# EAGLE design mcu (EAGLE 7.7.0)
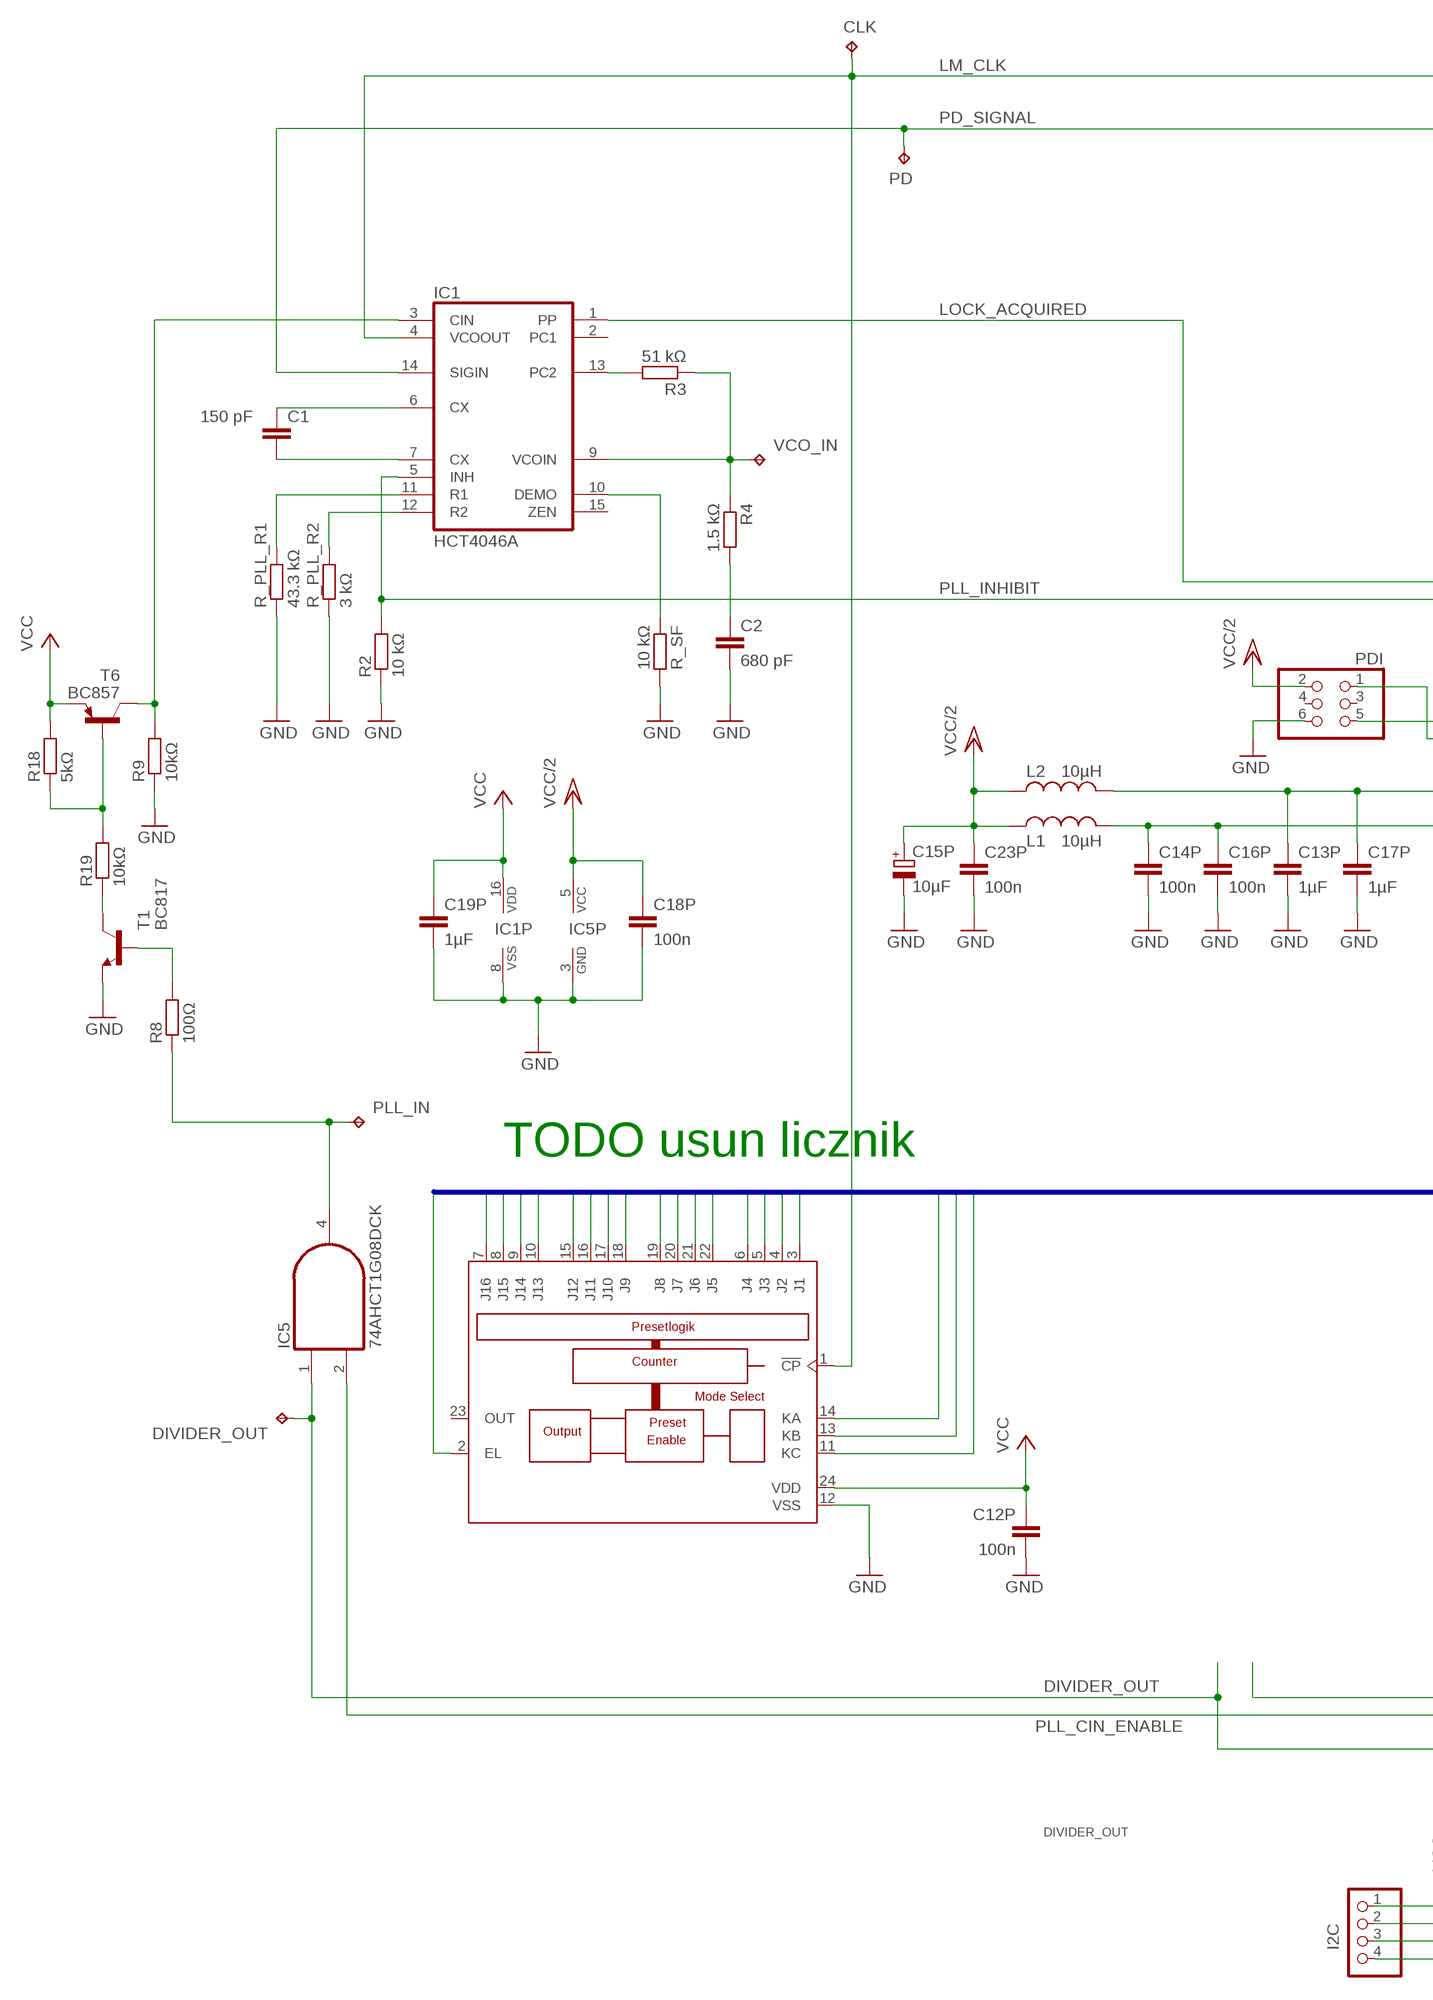
[diagram p0: schematic, sheet 1, part 1 of 2]
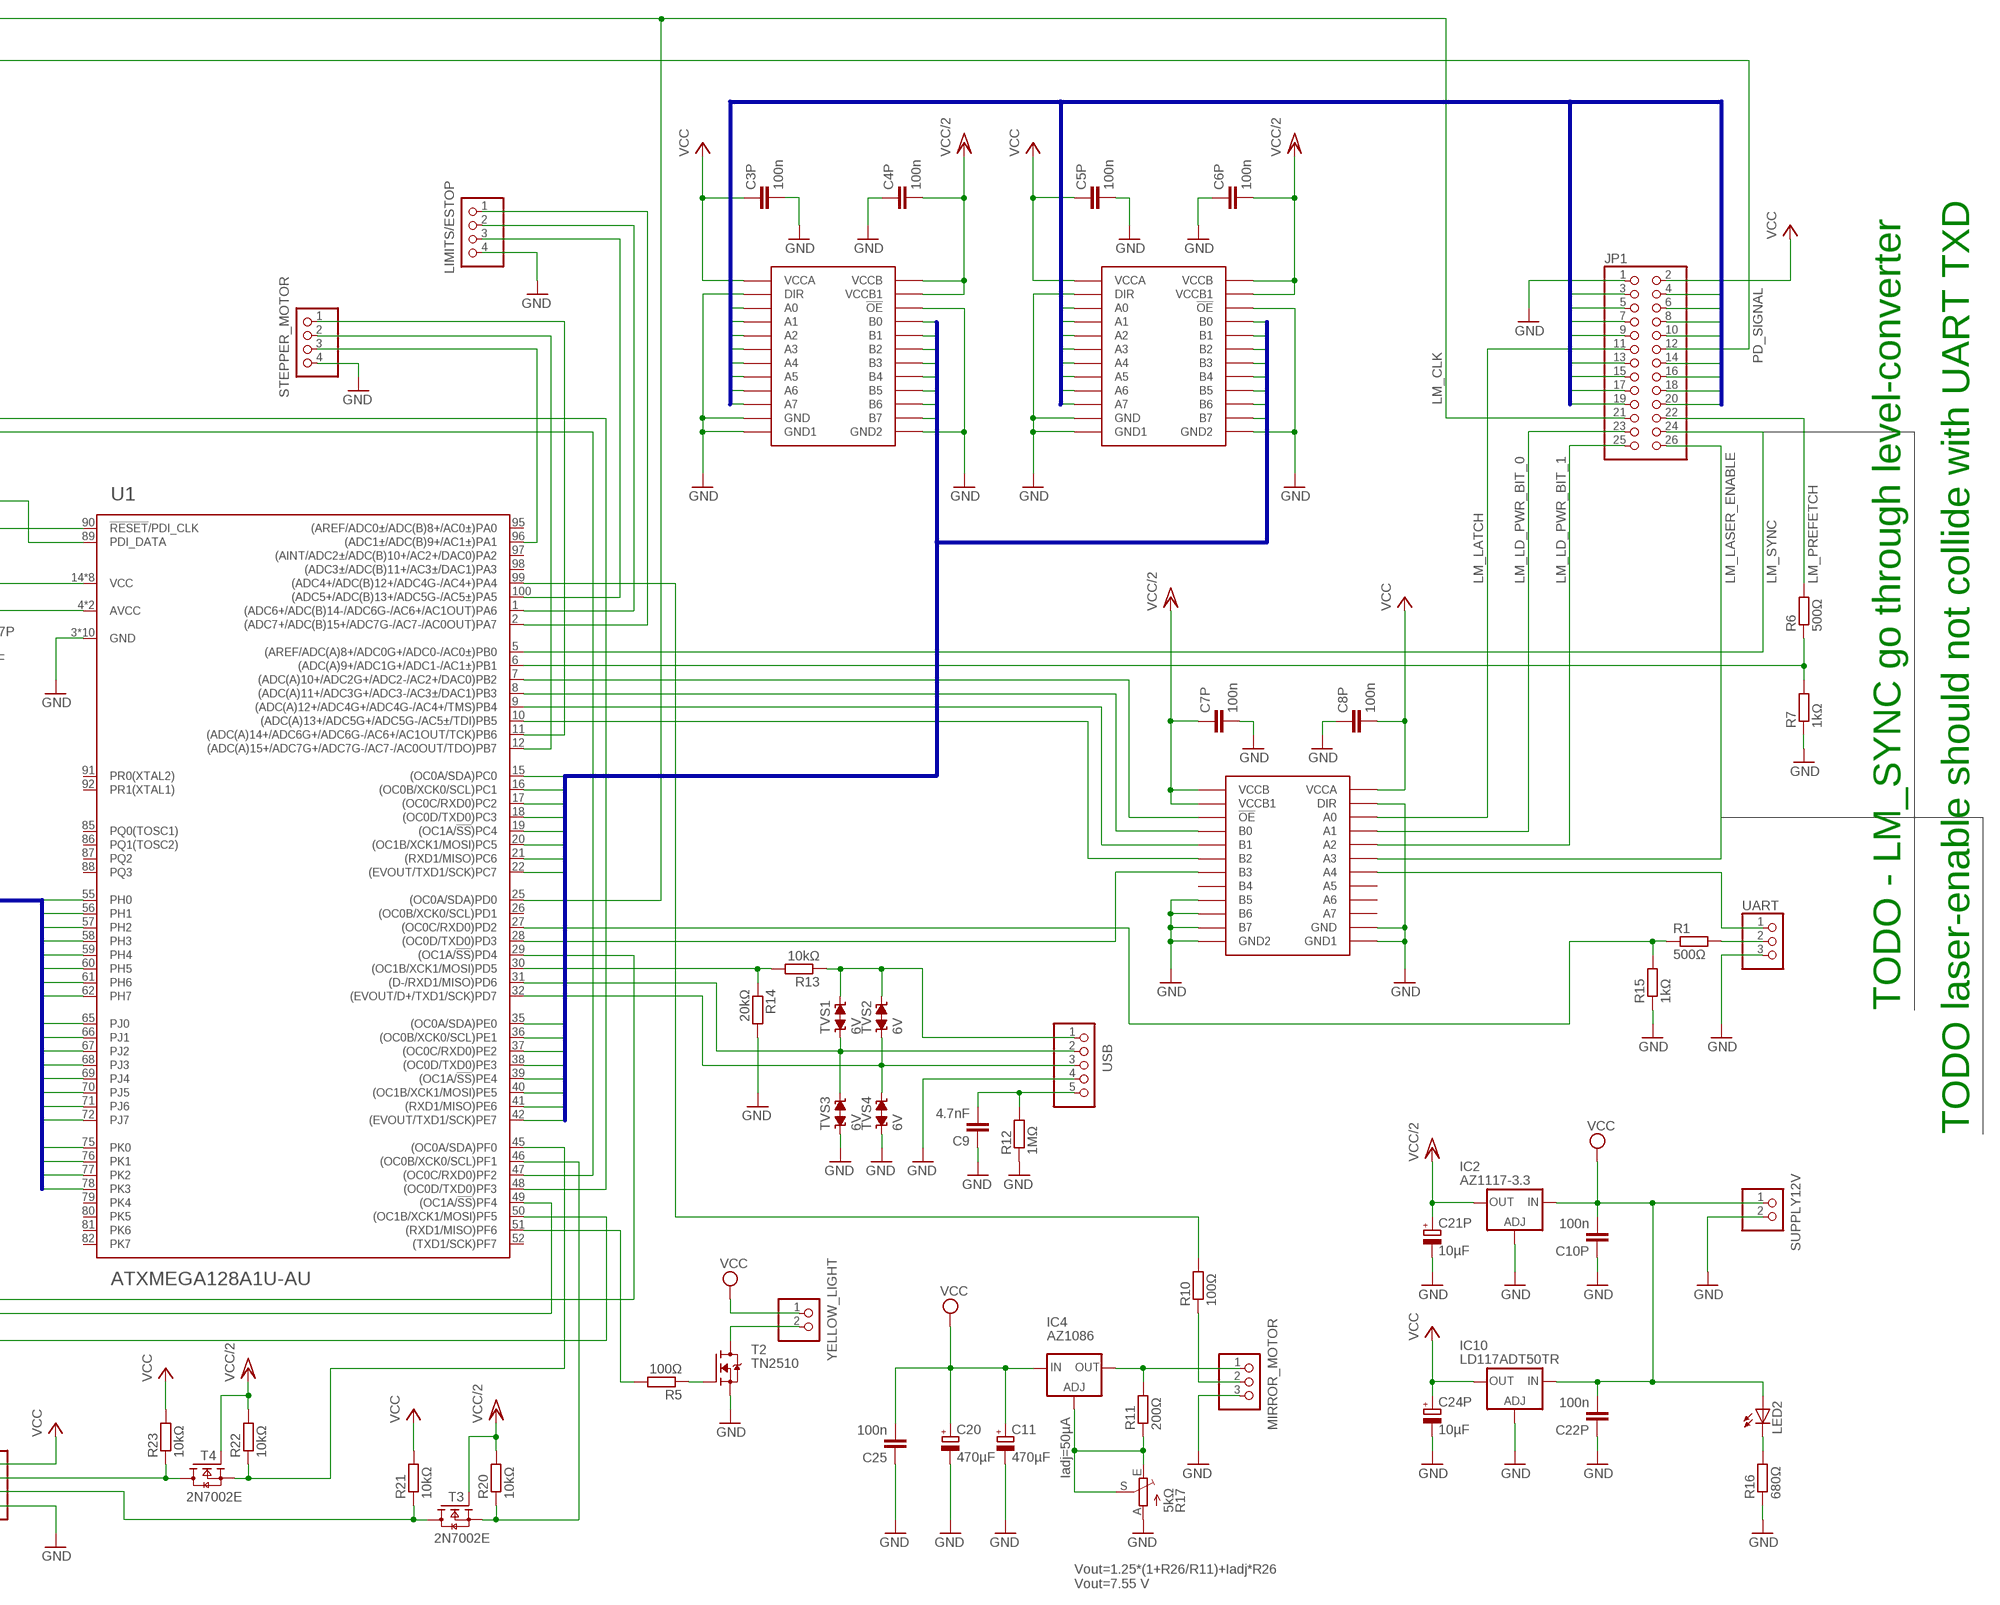
[diagram p1: schematic, sheet 1, part 2 of 2]

## Parts
C1  150 pF  C-EUC1206  [C1206]
C2  680 pF  C-EUC1206  [C1206]
C3P  100n  C-EUC0603  [C0603]
C4P  100n  C-EUC0603  [C0603]
C5P  100n  C-EUC0603  [C0603]
C6P  100n  C-EUC0603  [C0603]
C7P  100n  C-EUC0603  [C0603]
C8P  100n  C-EUC0603  [C0603]
C9  4.7nF  C-EUC1206  [C1206]
C10P  100n  C-EUC1206  [C1206]
C11  470µF  CPOL-EU153CLV-0807  [153CLV-0807]
C12P  100n  C-EUC1206  [C1206]
C13P  1µF  C-EUC1206  [C1206]
C14P  100n  C-EUC1206  [C1206]
C15P  10µF  CPOL-EUA/3216-18R  [A/3216-18R]
C16P  100n  C-EUC1206  [C1206]
C17P  1µF  C-EUC1206  [C1206]
C18P  100n  C-EUC1206  [C1206]
C19P  1µF  C-EUC1206  [C1206]
C20  470µF  CPOL-EU153CLV-0807  [153CLV-0807]
C21P  10µF  CPOL-EUA/3216-18R  [A/3216-18R]
C22P  100n  C-EUC1206  [C1206]
C23P  100n  C-EUC1206  [C1206]
C24P  10µF  CPOL-EUA/3216-18R  [A/3216-18R]
C25  100n  C-EUC1206  [C1206]
CLK  TPB1,27  [B1,27]
DIVIDER_OUT  TPB1,27  [B1,27]
I2C  PINHD-1X4  [1X04]
IC1  HCT4046A  4046D  [SO16]
IC2  AZ1117-3.3  LD117ADT33TR  [DPACK]
IC3  4059D  [SO24W]
IC4  AZ1086  LD117AD2MTR  [D2PACK]
IC5  74AHCT1G08DCK  [SC70-5]
IC7  74LVX4245TSSOP24W  [TSSOP-24-W]
IC8  74LVX4245TSSOP24W  [TSSOP-24-W]
IC9  74LVX4245TSSOP24W  [TSSOP-24-W]
IC10  LD117ADT50TR  [DPACK]
JP1  PINHD-2X13  [2X13]
L1  10µH  L-USL1812  [L1812]
L2  10µH  L-USL1812  [L1812]
LED2  LEDCHIPLED_0805  [CHIPLED_0805]
LIMITS/ESTOP  PINHD-1X4  [1X04]
MIRROR_MOTOR  PINHD-1X3  [1X03]
PD  TPB1,27  [B1,27]
PDI  PINHD-2X3  [2X03]
PLL_IN  TPB1,27  [B1,27]
R1  500Ω  R-EU_R0603  [R0603]
R2  10 kΩ  R-EU_R0603  [R0603]
R3  51 kΩ  R-EU_R0603  [R0603]
R4  1.5 kΩ  R-EU_R0603  [R0603]
R5  100Ω  R-EU_R0603  [R0603]
R6  500Ω  R-EU_R0603  [R0603]
R7  1kΩ  R-EU_R0603  [R0603]
R8  100Ω  R-EU_R0603  [R0603]
R9  10kΩ  R-EU_R0603  [R0603]
R10  100Ω  R-EU_R0603  [R0603]
R11  200Ω  R-EU_R1206  [R1206]
R12  1MΩ  R-EU_R0603  [R0603]
R13  10kΩ  R-EU_R0603  [R0603]
R14  20kΩ  R-EU_R0603  [R0603]
R15  1kΩ  R-EU_R0603  [R0603]
R16  680Ω  R-EU_R0603  [R0603]
R17  5kΩ  TRIM_EU-B64Y  [B64Y]
R18  5kΩ  R-EU_R0603  [R0603]
R19  10kΩ  R-EU_R0603  [R0603]
R20  10kΩ  R-EU_R0603  [R0603]
R21  10kΩ  R-EU_R0603  [R0603]
R22  10kΩ  R-EU_R0603  [R0603]
R23  10kΩ  R-EU_R0603  [R0603]
R_PLL_R1  43.3 kΩ  R-EU_R0603  [R0603]
R_PLL_R2  3 kΩ  R-EU_R0603  [R0603]
R_SF  10 kΩ  R-EU_R0603  [R0603]
STEPPER_MOTOR  PINHD-1X4  [1X04]
SUPPLY12V  PINHD-1X2  [1X02]
T1  BC817  BC817-40-NPN-SOT23-BEC  [SOT23-BEC]
T2  TN2510  [SOT89]
T3  2N7002E  [SOT23]
T4  2N7002E  [SOT23]
T6  BC857  BC857C-PNP-SOT23-BEC  [SOT23-BEC]
TVS1  6V  TVS-0805  [TVS0805]
TVS2  6V  TVS-0805  [TVS0805]
TVS3  6V  TVS-0805  [TVS0805]
TVS4  6V  TVS-0805  [TVS0805]
U1  ATXMEGA128A1U-AU  [TQFP-100A-100]
UART  PINHD-1X3  [1X03]
USB  PINHD-1X5  [1X05]
VCO_IN  TPB1,27  [B1,27]
YELLOW_LIGHT  PINHD-1X2  [1X02]

## Nets
CTR0_KA: IC3.14(KA) U1.75(PK0)
CTR0_KB: IC3.13(KB) U1.76(PK1)
CTR0_KC: IC3.11(KC) U1.77(PK2)
CTR0_LE: IC3.2(EL) U1.78(PK3)
CTR0_PROG0: IC3.3(J1) U1.55(PH0)
CTR0_PROG1: IC3.4(J2) U1.56(PH1)
CTR0_PROG2: IC3.5(J3) U1.57(PH2)
CTR0_PROG3: IC3.6(J4) U1.58(PH3)
CTR0_PROG4: IC3.22(J5) U1.59(PH4)
CTR0_PROG5: IC3.21(J6) U1.60(PH5)
CTR0_PROG6: IC3.20(J7) U1.61(PH6)
CTR0_PROG7: IC3.19(J8) U1.62(PH7)
CTR0_PROG8: IC3.18(J9) U1.65(PJ0)
CTR0_PROG9: IC3.17(J10) U1.66(PJ1)
CTR0_PROG10: IC3.16(J11) U1.67(PJ2)
CTR0_PROG11: IC3.15(J12) U1.68(PJ3)
CTR0_PROG12: IC3.10(J13) U1.69(PJ4)
CTR0_PROG13: IC3.9(J14) U1.70(PJ5)
CTR0_PROG14: IC3.8(J15) U1.71(PJ6)
CTR0_PROG15: IC3.7(J16) U1.72(PJ7)
DIVIDER_OUT: DIVIDER_OUT.TP IC5.1(I0) U1.50((OC1B/XCK1/MOSI)PF5)
GND: C2.2 C3P.2 C4P.1 C5P.2 C6P.1 C7P.2 C8P.1 C9.1 C10P.1 C11.- C12P.1 C13P.2 C14P.2 C15P.- C16P.2 C17P.2 C18P.2 C19P.2 C20.- C21P.- C22P.1 C23P.2 C24P.- C25.1 I2C.4 IC1.8(VSS) IC2.1(ADJ) IC3.12(VSS) IC5.3(GND) IC7.2(DIR) IC7.11(GND) IC7.12(GND1) IC7.13(GND2) IC7.22(!OE) IC8.2(DIR) IC8.11(GND) IC8.12(GND1) IC8.13(GND2) IC8.22(!OE) IC9.2(DIR) IC9.11(GND) IC9.12(GND1) IC9.13(GND2) IC9.14(B7) IC9.15(B6) IC9.16(B5) IC10.1(ADJ) JP1.1 LIMITS/ESTOP.4 MIRROR_MOTOR.3 PDI.6 R2.1 R7.1 R9.1 R12.1 R14.2 R15.1 R16.1 R17.A R_PLL_R1.1 R_PLL_R2.1 R_SF.2 STEPPER_MOTOR.4 SUPPLY12V.2 T1.E T2.3(S) TVS3.1 TVS4.1 U1.3(GND) U1.13(GND) U1.23(GND) U1.33(GND) U1.43(GND) U1.53(GND) U1.63(GND) U1.73(GND) U1.84(GND) U1.93(GND) UART.3 USB.4
I2C_SDA_3V2: R20.1 T3.2(S) U1.46((OC0B/XCK0/SCL)PF1)
I2C_SDA_3V4: R22.1 T4.2(S) U1.45((OC0A/SDA)PF0)
I2C_SDA_5V2: I2C.3 R21.1 T3.3(D)
I2C_SDA_5V3: I2C.2 R23.1 T4.3(D)
LM_CLK: CLK.TP IC1.4(VCOOUT) IC3.1(!CP) JP1.21 U1.25((OC0A/SDA)PD0)
LM_DATA_3V3_0: IC7.21(B0) U1.35((OC0A/SDA)PE0)
LM_DATA_3V3_1: IC7.20(B1) U1.36((OC0B/XCK0/SCL)PE1)
LM_DATA_3V3_2: IC7.19(B2) U1.37((OC0C/RXD0)PE2)
LM_DATA_3V3_3: IC7.18(B3) U1.38((OC0D/TXD0)PE3)
LM_DATA_3V3_4: IC7.17(B4) U1.39((OC1A/!SS!)PE4)
LM_DATA_3V3_5: IC7.16(B5) U1.40((OC1B/XCK1/MOSI)PE5)
LM_DATA_3V3_6: IC7.15(B6) U1.41((RXD1/MISO)PE6)
LM_DATA_3V3_7: IC7.14(B7) U1.42((EVOUT/TXD1/SCK)PE7)
LM_DATA_3V3_8: IC8.21(B0) U1.15((OC0A/SDA)PC0)
LM_DATA_3V3_9: IC8.20(B1) U1.16((OC0B/XCK0/SCL)PC1)
LM_DATA_3V3_10: IC8.19(B2) U1.17((OC0C/RXD0)PC2)
LM_DATA_3V3_11: IC8.18(B3) U1.18((OC0D/TXD0)PC3)
LM_DATA_3V3_12: IC8.17(B4) U1.19((OC1A/!SS!)PC4)
LM_DATA_3V3_13: IC8.16(B5) U1.20((OC1B/XCK1/MOSI)PC5)
LM_DATA_3V3_14: IC8.15(B6) U1.21((RXD1/MISO)PC6)
LM_DATA_3V3_15: IC8.14(B7) U1.22((EVOUT/TXD1/SCK)PC7)
LM_DATA_5V0: IC7.10(A7) JP1.3
LM_DATA_5V1: IC7.9(A6) JP1.4
LM_DATA_5V2: IC7.8(A5) JP1.5
LM_DATA_5V3: IC7.7(A4) JP1.6
LM_DATA_5V4: IC7.6(A3) JP1.7
LM_DATA_5V5: IC7.5(A2) JP1.8
LM_DATA_5V6: IC7.4(A1) JP1.9
LM_DATA_5V7: IC7.3(A0) JP1.10
LM_DATA_5V8: IC8.10(A7) JP1.13
LM_DATA_5V9: IC8.9(A6) JP1.14
LM_DATA_5V10: IC8.8(A5) JP1.15
LM_DATA_5V11: IC8.7(A4) JP1.16
LM_DATA_5V12: IC8.6(A3) JP1.17
LM_DATA_5V13: IC8.5(A2) JP1.18
LM_DATA_5V14: IC8.4(A1) JP1.19
LM_DATA_5V15: IC8.3(A0) JP1.20
LM_LASER_ENABLE: IC9.6(A3) JP1.26
LM_LATCH: IC9.3(A0) JP1.11
LM_LD_PWR_BIT_0: IC9.4(A1) JP1.23
LM_LD_PWR_BIT_1: IC9.5(A2) JP1.25
LM_PREFETCH: JP1.22 R6.2
LM_SYNC: JP1.24
LOCK_ACQUIRED: IC1.1(PP) U1.48((OC0D/TXD0)PF3)
N$1: R6.1 R7.2 U1.6((ADC(A)9+/ADC1G+/ADC1-/AC1±)PB1)
N$2: R18.1 R19.2 T6.B
N$3: LIMITS/ESTOP.3 U1.100((ADC5+/ADC(B)13+/ADC5G-/AC5±)PA5)
N$4: R5.2 U1.51((RXD1/MISO)PF6)
N$5: PDI.1 U1.89(PDI_DATA)
N$6: C1.1 IC1.6(CX)
N$7: IC9.22(!OE) U1.7((ADC(A)10+/ADC2G+/ADC2-/AC2+/DAC0)PB2)
N$8: C1.2 IC1.7(CX)
N$9: IC1.13(PC2) R3.2
N$10: IC1.9(VCOIN) R3.1 R4.1 VCO_IN.TP
N$11: C2.1 R4.2
N$12: IC1.10(DEMO) R_SF.1
N$13: IC1.11(R1) R_PLL_R1.2
N$14: IC1.12(R2) R_PLL_R2.2
N$15: IC9.21(B0) U1.8((ADC(A)11+/ADC3G+/ADC3-/AC3±/DAC1)PB3)
N$16: IC9.20(B1) U1.9((ADC(A)12+/ADC4G+/ADC4G-/AC4+/TMS)PB4)
N$17: IC9.19(B2) U1.10((ADC(A)13+/ADC5G+/ADC5G-/AC5±/TDI)PB5)
N$18: IC4.1(ADJ) R11.1 R17.E R17.S
N$19: IC4.2(OUT) MIRROR_MOTOR.1 R11.2
N$20: R10.2 U1.99((ADC4+/ADC(B)12+/ADC4G-/AC4+)PA4)
N$21: T2.2(D) T2.2@1(D) YELLOW_LIGHT.2
N$22: R5.1 T2.1(G)
N$23: PDI.5 U1.90(!RESET!/PDI_CLK)
N$24: TVS1.1 TVS3.2 U1.31((D-/RXD1/MISO)PD6) USB.2
N$25: TVS2.1 TVS4.2 U1.32((EVOUT/D+/TXD1/SCK)PD7) USB.3
N$26: R1.1 R15.2 U1.27((OC0C/RXD0)PD2)
N$27: MIRROR_MOTOR.2 R10.1
N$28: IC9.18(B3) U1.28((OC0D/TXD0)PD3)
N$29: R13.1 TVS1.2 TVS2.2 USB.1
N$30: C9.2 R12.2 USB.5
N$31: R13.2 R14.1 U1.30((OC1B/XCK1/MOSI)PD5)
N$32: STEPPER_MOTOR.3 U1.96((ADC1±/ADC(B)9+/AC1±)PA1)
N$33: LIMITS/ESTOP.2 U1.1((ADC6+/ADC(B)14-/ADC6G-/AC6+/AC1OUT)PA6)
N$34: LIMITS/ESTOP.1 U1.2((ADC7+/ADC(B)15+/ADC7G-/AC7-/AC0OUT)PA7)
N$35: STEPPER_MOTOR.1 U1.11((ADC(A)14+/ADC6G+/ADC6G-/AC6+/AC1OUT/TCK)PB6)
N$36: STEPPER_MOTOR.2 U1.12((ADC(A)15+/ADC7G+/ADC7G-/AC7-/AC0OUT/TDO)PB7)
N$37: LED2.C R16.2
N$38: IC9.7(A4) UART.1
N$39: R1.2 UART.2
N$41: R8.2 T1.B
N$42: R19.1 T1.C
N$43: C13P.1 C17P.1 L2.1 U1.14(VCC) U1.24(VCC) U1.34(VCC) U1.44(VCC) U1.54(VCC) U1.64(VCC) U1.74(VCC) U1.83(VCC)
N$44: C14P.1 C16P.1 L1.1 U1.4(AVCC) U1.94(AVCC)
N$77: U1.5((AREF/ADC(A)8+/ADC0G+/ADC0-/AC0±)PB0)
PD4: U1.29((OC1A/!SS!)PD4)
PD_SIGNAL: IC1.14(SIGIN) JP1.12 PD.TP
PLL_CIN_ENABLE: IC5.2(I1) U1.49((OC1A/!SS!)PF4)
PLL_IN_3V3: IC5.4(O) PLL_IN.TP R8.1
PLL_IN_5V: IC1.3(CIN) R9.2 T6.C
PLL_INHIBIT: IC1.5(INH) R2.2 U1.47((OC0C/RXD0)PF2)
VCC/3.3V: C4P.2 C6P.2 C7P.1 C15P.+ C18P.1 C21P.+ C23P.1 IC2.4(OUT) IC5.5(VCC) IC7.23(VCCB1) IC7.24(VCCB) IC8.23(VCCB1) IC8.24(VCCB) IC9.23(VCCB1) IC9.24(VCCB) L1.2 L2.2 PDI.2 R20.2 R22.2 T3.1(G) T4.1(G) ; supply symbol labelled VCC/2
VCC/5V: C3P.1 C5P.1 C8P.2 C12P.2 C19P.1 C24P.+ I2C.1 IC1.16(VDD) IC3.24(VDD) IC7.1(VCCA) IC8.1(VCCA) IC9.1(VCCA) IC10.4(OUT) JP1.2 R18.2 R21.2 R23.2 T6.E ; supply symbol labelled VCC
VCC/12V: C10P.2 C11.+ C20.+ C22P.2 C25.2 IC2.3(IN) IC4.3(IN) IC10.3(IN) LED2.A SUPPLY12V.1 YELLOW_LIGHT.1 ; supply symbol labelled VCC
Unconnected: IC1.2(PC1) IC1.15(ZEN) IC3.23(OUT) IC9.8(A5) IC9.9(A6) IC9.10(A7) IC9.17(B4) PDI.3 PDI.4 U1.26((OC0B/XCK0/SCL)PD1) U1.52((TXD1/SCK)PF7) U1.79(PK4) U1.80(PK5) U1.81(PK6) U1.82(PK7) U1.85(PQ0(TOSC1)) U1.86(PQ1(TOSC2)) U1.87(PQ2) U1.88(PQ3) U1.91(PR0(XTAL2)) U1.92(PR1(XTAL1)) U1.95((AREF/ADC0±/ADC(B)8+/AC0±)PA0) U1.97((AINT/ADC2±/ADC(B)10+/AC2+/DAC0)PA2) U1.98((ADC3±/ADC(B)11+/AC3±/DAC1)PA3)

## Buses
LM_DATA_5V[0..15]
CTR0_PROG[0..15],CTR0_KA,CTR0_KB,CTR0_KC,CTR0_LE
LM_DATA_3V3_[0..15]

## Notes on the sheet
- TODO usun licznik
- TODO - LM_SYNC go through level-converter
- TODO laser-enable should not collide with UART TXD
- Iadj=50µA
- Vout=1.25*(1+R26/R11)+Iadj*R26
  Vout=7.55 V

## Library data of the parts
C1 C2 C3P C4P C5P C6P C7P C8P C9 C10P C12P C13P C14P C16P C17P C18P C19P C22P C23P C25 = rcl:C-EU: CAPACITOR, European symbol
C11 C15P C20 C21P C24P = rcl:CPOL-EU: POLARIZED CAPACITOR, European symbol
CLK DIVIDER_OUT PD PLL_IN VCO_IN = testpad:TP: Test pad
I2C LIMITS/ESTOP STEPPER_MOTOR = pinhead:PINHD-1X4: PIN HEADER
IC1 = 40xx:4046: Micropower PLL
IC2 IC4 IC10 = v-reg:LD117A?*: Low drop fixed and adjustable positive voltage regulators 1 A Source: http://www.st.com/stonline/products/literature/ds/7194/ld1117axx.pdf
IC3 = 40xx:4059: Devide by-N-Counter 74HC/HCT4059 Source: www.standardics.nxp.com/products/hc/datasheet/74hc4059.pdf
IC5 = 74xx-little-us:74*1G08: 2-input AND gate
IC7-IC9 = 74lvx4245:74LVX4245
JP1 = pinhead:PINHD-2X13: PIN HEADER
L1 L2 = rcl:L-US: INDUCTOR, American symbol
LED2 = led:LED: LED OSRAM: - CHIPLED LG R971, LG N971, LY N971, LG Q971, LY Q971, LO R971, LY R971 LH N974, LH R974 LS Q976, LO Q976, LY Q976 LO Q996 - Hyper CHIPLED LW Q18S LB Q993, LB Q99A, LB R99A - SideLED LS A670, LO A670, LY A670, LG A670, LP A670 LB A673, LV A673, LT A673, LW A673 LH A674 LY A675 LS A676, LA A676, LO A676, LY A676, LW A676 LS A679, LY A679, LG A679 - Hyper Micro SIDELED® LS Y876, LA Y876, LO Y876, LY Y876 LT Y87S - SmartLED LW L88C, LW L88S LB L89C, LB L89S, LG L890 LS L89K, LO L89K, LY L89K LS L896, LA L896, LO L896, LY L896 - TOPLED LS T670, LO T670, LY T670, LG T670, LP T670 LSG T670, LSP T670, LSY T670, LOP T670, LYG T670 LG T671, LOG T671, LSG T671 LB T673, LV T673, LT T673, LW T673 LH T674 LS T676, LA T676, LO T676, LY T676, LB T676, LH T676, LSB T676, LW T676 LB T67C, LV T67C, LT T67C, LS T67K, LO T67K, LY T67K, LW E67C LS E67B, LA E67B, LO E67B, LY E67B, LB E67C, LV E67C, LT E67C LW T67C LS T679, LY T679, LG T679 LS T770, LO T770, LY T770, LG T770, LP T770 LB T773, LV T773, LT T773, LW T773 LH T774 LS E675, LA E675, LY E675, LS T675 LS T776, LA T776, LO T776, LY T776, LB T776 LHGB T686 LT T68C, LB T68C - Hyper Mini TOPLED® LB M676 - Mini TOPLED Santana® LG M470 LS M47K, LO M47K, LY M47K Source: http://www.osram.convergy.de LUXEON: - LUMILED® LXK2-PW12-R00, LXK2-PW12-S00, LXK2-PW14-U00, LXK2-PW14-V00 LXK2-PM12-R00, LXK2-PM12-S00, LXK2-PM14-U00 LXK2-PE12-Q00, LXK2-PE12-R00, LXK2-PE12-S00, LXK2-PE14-T00, LXK2-PE14-U00 LXK2-PB12-K00, LXK2-PB12-L00, LXK2-PB12-M00, LXK2-PB14-N00, LXK2-PB14-P00, LXK2-PB14-Q00 LXK2-PR12-L00, LXK2-PR12-M00, LXK2-PR14-Q00, LXK2-PR14-R00 LXK2-PD12-Q00, LXK2-PD12-R00, LXK2-PD12-S00 LXK2-PH12-R00, LXK2-PH12-S00 LXK2-PL12-P00, LXK2-PL12-Q00, LXK2-PL12-R00 Source: www.luxeon.com KINGBRIGHT: KA-3528ASYC Source: www.kingbright.com
MIRROR_MOTOR UART = pinhead:PINHD-1X3: PIN HEADER
PDI = pinhead:PINHD-2X3: PIN HEADER
R1-R16 R18-R23 R_PLL_R1 R_PLL_R2 R_SF = rcl:R-EU_: RESISTOR, European symbol
R17 = pot:TRIM_EU-: POTENTIOMETER
SUPPLY12V YELLOW_LIGHT = pinhead:PINHD-1X2: PIN HEADER
T1 = transistor:*-NPN-: NPN Transistror BF959 corrected 2008.03.06
T2 = mulabs:TN2510
T3 T4 = nxp_60:2N7002: N-channel TrenchMOS FET N-channel enhancement mode Field-Effect Transistor (FET) in a plastic package using TrenchMOS technology. AAL Eindhoven MK
T6 = transistor:*-PNP-: PNP Transistror
TVS1-TVS4 = supressor:TVS-: TVS BI-DIRECTIONAL
U1 = atmega-atxmega:ATXMEGA128A1U: 8/16-bit XMEGA A1U Microcontroller Features High-performance, low-power Atmel® AVR® XMEGA® 8/16-bit Microcontroller Nonvolatileprogram and data memories – 64K - 128KBytes of in-system self-programmable flash – 4K - 8KBytes boot section – 2KBytes EEPROM – 4K - 8KBytes internal SRAM External bus interface for up to 16Mbytes SRAM External bus interface for up to 128Mbit SDRAM Peripheral features – Four-channel DMA controller – Eight-channel event system – Eight 16-bit timer/counters Four timer/counters with 4 output compare or input capture channels Four timer/counters with 2 output compare or input capture channels High resolution extension on all timer/counters Advanced waveform extension (AWeX) on two timer/counters – One USB device interface USB 2.0 full speed (12Mbps) and low speed (1.5Mbps) device compliant 32 Endpoints with full configuration flexibility – Eight USARTs with IrDA support for one USART – Four two-wire interfaces with dual address match (I2C and SMBus compatible) – Four serial peripheral interfaces (SPIs) – AES and DES crypto engine – CRC-16 (CRC-CCITT) and CRC-32 (IEEE® 802.3) generator – 16-bit real time counter (RTC) with separate oscillator – Two sixteen channel, 12-bit, 2msps Analog to Digital Converters – Two Two-channel, 12-bit, 1msps Digital to Analog Converters – Four Analog Comparators (ACs) with window compare function, and current sources – External interrupts on all general purpose I/O pins – Programmable watchdog timer with separate on-chip ultra low power oscillator – QTouch® library support Capacitive touch buttons, sliders and wheels Special microcontroller features – Power-on reset and programmable brown-out detection – Internal and external clock options with PLL and prescaler – Programmable multilevel interrupt controller – Five sleep modes – Programming and debug interfaces JTAG (IEEE 1149.1 compliant) interface, including boundary scan PDI (Program and Debug Interface) I/O and packages – 78 Programmable I/O pins – 100 lead TQFP – 100 ball BGA – 100 ball VFBGA Operating voltage – 1.6 – 3.6V Operating frequency – 0 – 12MHz from 1.6V – 0 – 32MHz from 2.7V
USB = pinhead:PINHD-1X5: PIN HEADER

## Board
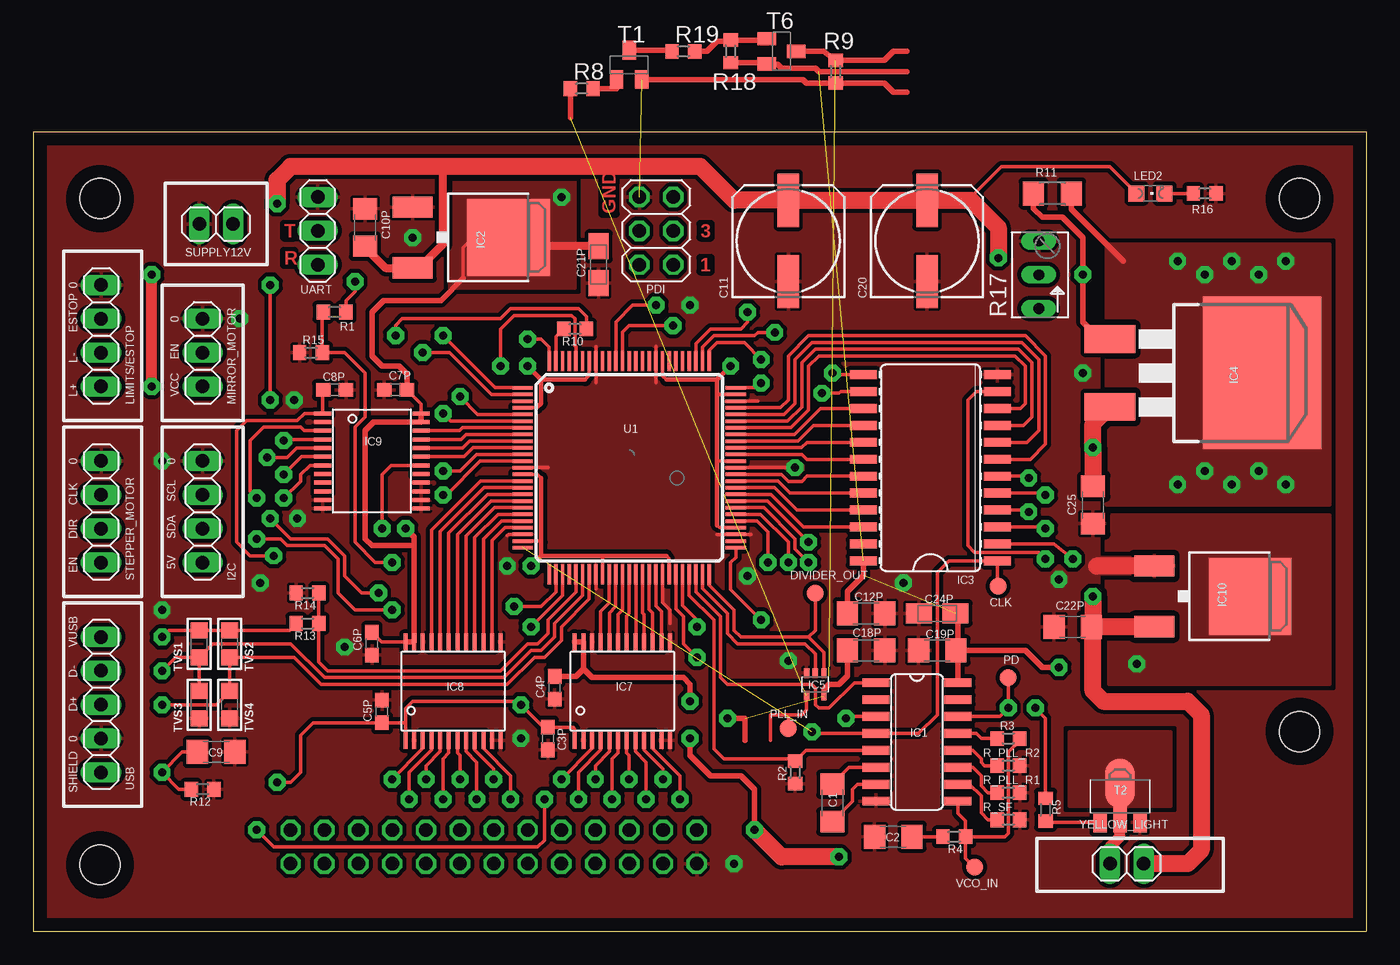
[diagram p2: board, top side]
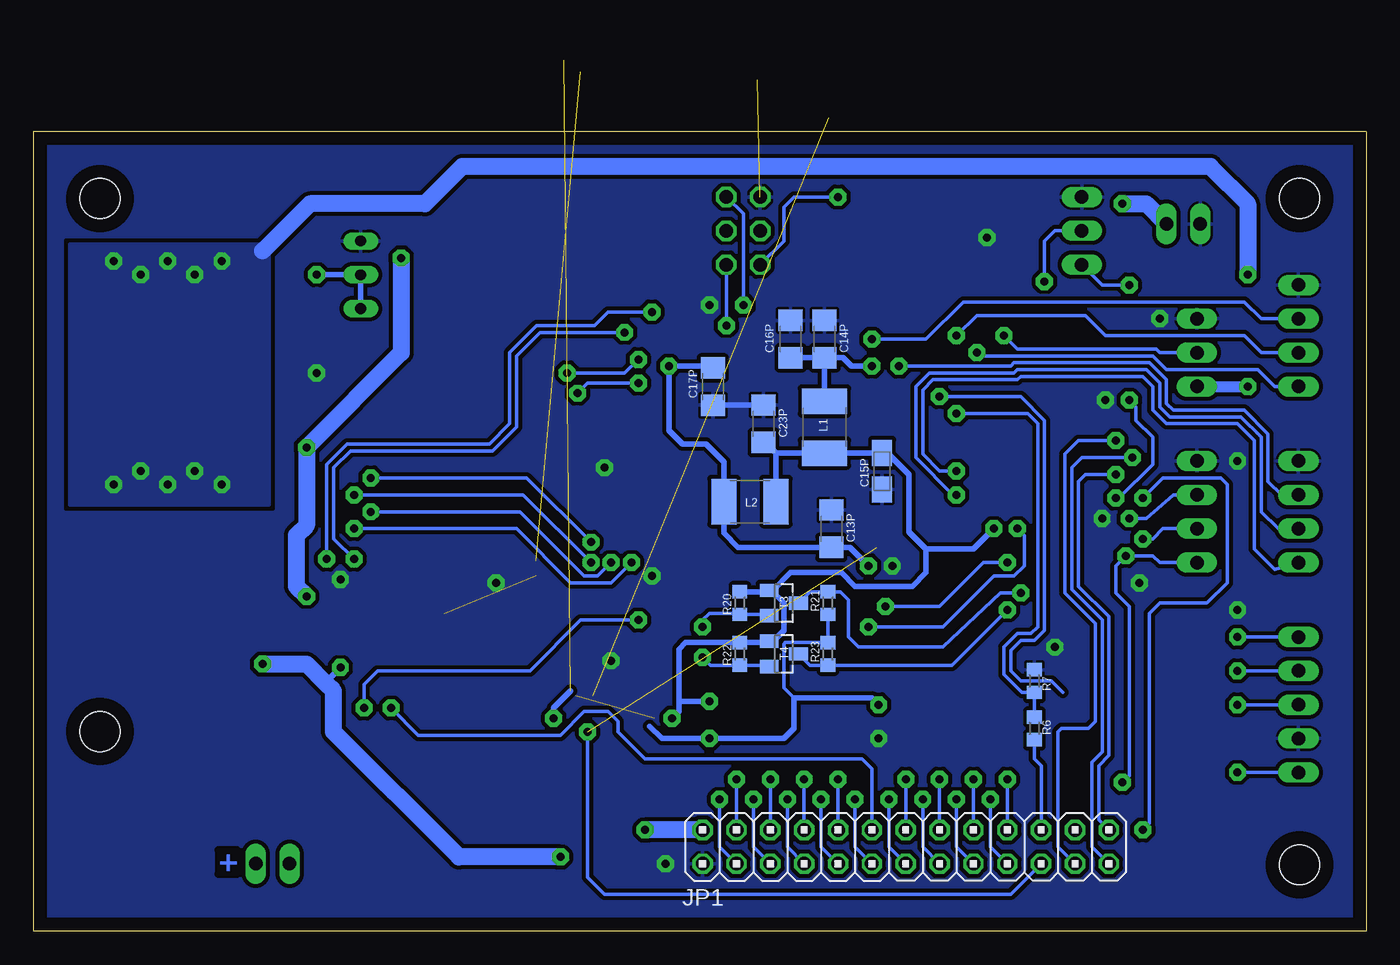
[diagram p3: board, bottom side, seen from below]

Size 100 x 60 mm. Coordinates in mm from the lower left corner, seen from the top.
Outline: 0,0 100,0 100,60 0,60 0,0
Copper layers (1*16): Top 0.035mm / dielectric 1.5mm / Bottom 0.035mm
Design rules "default *": minimum track width 10mil, minimum drill 24mil, track to track 8mil, track to pad 8mil, pad to pad 8mil, via to via 8mil, smd to smd 8mil, copper to edge 40mil, drill to drill 8mil, minimum pad ring 10mil, minimum via ring 8mil, stop-mask expansion 4mil, vias tented up to drill 0mil, thermal gap 8mil
Holes 3 mm at 5,55 5,5 95,15 95,55
tRestrict: area 58.2,34.5 to 61,35.1

### Footprints (pad centres in the part's own frame; a part is rotated, then mirrored left to right if it is on the bottom)
C1206 = smd 1.6 x 1.8: 1 -1.4,0; 2 1.4,0
C0603 = smd 1.1 x 1: 1 -0.85,0; 2 0.85,0
153CLV-0807 = smd 4 x 1.6: + 3.05,0; - -3.05,0
A/3216-18R = smd 1.95 x 1.5: + 1.375,0; - -1.375,0
B1,27 = smd 1.27 x 1.27: TP 0,0
1X04 = drill 1.016 long: 1 -3.81,0; 2 -1.27,0; 3 1.27,0; 4 3.81,0
SO16 = smd 0.66 x 2.032: 1 -4.445,-3.073; 2 -3.175,-3.073; 3 -1.905,-3.073; 4 -0.635,-3.073; 5 0.635,-3.073; 6 1.905,-3.073; 7 3.175,-3.073; 8 4.445,-3.073; 9 4.445,3.073; 10 3.175,3.073; 11 1.905,3.073; 12 0.635,3.073; 13 -0.635,3.073; 14 -1.905,3.073; 15 -3.175,3.073; 16 -4.445,3.073
DPACK = smd 1.6 x 3: 1 -2.28,-4.8; 3 2.28,-4.8 | smd 5.8 x 6.2: 4 0,2.38
SO24W = smd 0.66 x 2.032: 1 -6.985,-5.029; 2 -5.715,-5.029; 3 -4.445,-5.029; 4 -3.175,-5.029; 5 -1.905,-5.029; 6 -0.635,-5.029; 7 0.635,-5.029; 8 1.905,-5.029; 9 3.175,-5.029; 10 4.445,-5.029; 11 5.715,-5.029; 12 6.985,-5.029; 13 6.985,5.029; 14 5.715,5.029; 15 4.445,5.029; 16 3.175,5.029; 17 1.905,5.029; 18 0.635,5.029; 19 -0.635,5.029; 20 -1.905,5.029; 21 -3.175,5.029; 22 -4.445,5.029; 23 -5.715,5.029; 24 -6.985,5.029
D2PACK = smd 2.083 x 3.81: 1 -2.54,-8.89; 3 2.54,-8.89 | smd 11.43 x 8.89: 2 0,2.54
SC70-5 = smd 0.4 x 0.7: 1 -0.65,-0.85; 2 0,-0.85; 3 0.65,-0.85; 4 0.65,0.85; 5 -0.65,0.85
TSSOP-24-W = smd 0.305 x 1.27: 1 -3.575,-3.68; 2 -2.925,-3.68; 3 -2.275,-3.68; 4 -1.625,-3.68; 5 -0.975,-3.68; 6 -0.325,-3.68; 7 0.325,-3.68; 8 0.975,-3.68; 9 1.625,-3.68; 10 2.275,-3.68; 11 2.925,-3.68; 12 3.575,-3.68; 13 3.575,3.68; 14 2.925,3.68; 15 2.275,3.68; 16 1.625,3.68; 17 0.975,3.68; 18 0.325,3.68; 19 -0.325,3.68; 20 -0.975,3.68; 21 -1.625,3.68; 22 -2.275,3.68; 23 -2.925,3.68; 24 -3.575,3.68
2X13 = drill 1.016 octagon: 1 -15.24,-1.27; 2 -15.24,1.27; 3 -12.7,-1.27; 4 -12.7,1.27; 5 -10.16,-1.27; 6 -10.16,1.27; 7 -7.62,-1.27; 8 -7.62,1.27; 9 -5.08,-1.27; 10 -5.08,1.27; 11 -2.54,-1.27; 12 -2.54,1.27; 13 0,-1.27; 14 0,1.27; 15 2.54,-1.27; 16 2.54,1.27; 17 5.08,-1.27; 18 5.08,1.27; 19 7.62,-1.27; 20 7.62,1.27; 21 10.16,-1.27; 22 10.16,1.27; 23 12.7,-1.27; 24 12.7,1.27; 25 15.24,-1.27; 26 15.24,1.27
L1812 = smd 1.9 x 3.4: 1 -1.95,0; 2 1.95,0
CHIPLED_0805 = smd 1.2 x 1.2: A 0,-1.05; C 0,1.05
1X03 = drill 1.016 long: 1 -2.54,0; 2 0,0; 3 2.54,0
2X03 = drill 1.016 octagon: 1 -2.54,-1.27; 2 -2.54,1.27; 3 0,-1.27; 4 0,1.27; 5 2.54,-1.27; 6 2.54,1.27
R0603 = smd 1 x 1.1: 1 -0.85,0; 2 0.85,0
R1206 = smd 1.6 x 1.803: 1 -1.422,0; 2 1.422,0
B64Y = drill 0.813 long: A 2.54,0; E -2.54,0; S 0,0
1X02 = drill 1.016 long: 1 -1.27,0; 2 1.27,0
SOT23-BEC = smd 1 x 1.4: B -0.95,-1.1; C 0,1.1; E 0.95,-1.1
SOT89 = smd 1 x 1.5: 1 -1.499,-1.981; 3 1.499,-1.981 | smd 1 x 2: 2 0,-1.727 | smd 2.2 x 3.7: 2@1 0,0.94
SOT23 = smd 1 x 1.4: 1 -0.95,-1.1; 2 0.95,-1.1; 3 0,1.1
TVS0805 = smd 1.2 x 1.3: 1 -1.016,0; 2 1.016,0
TQFP-100A-100 = smd 1.524 x 0.254: 1 -8,6; 2 -8,5.5; 3 -8,5; 4 -8,4.5; 5 -8,4; 6 -8,3.5; 7 -8,3; 8 -8,2.5; 9 -8,2; 10 -8,1.5; 11 -8,1; 12 -8,0.5; 13 -8,0; 14 -8,-0.5; 15 -8,-1; 16 -8,-1.5; 17 -8,-2; 18 -8,-2.5; 19 -8,-3; 20 -8,-3.5; 21 -8,-4; 22 -8,-4.5; 23 -8,-5; 24 -8,-5.5; 25 -8,-6; 51 8,-6; 52 8,-5.5; 53 8,-5; 54 8,-4.5; 55 8,-4; 56 8,-3.5; 57 8,-3; 58 8,-2.5; 59 8,-2; 60 8,-1.5; 61 8,-1; 62 8,-0.5; 63 8,0; 64 8,0.5; 65 8,1; 66 8,1.5; 67 8,2; 68 8,2.5; 69 8,3; 70 8,3.5; 71 8,4; 72 8,4.5; 73 8,5; 74 8,5.5; 75 8,6 | smd 0.254 x 1.524: 26 -6,-8; 27 -5.5,-8; 28 -5,-8; 29 -4.5,-8; 30 -4,-8; 31 -3.5,-8; 32 -3,-8; 33 -2.5,-8; 34 -2,-8; 35 -1.5,-8; 36 -1,-8; 37 -0.5,-8; 38 0,-8; 39 0.5,-8; 40 1,-8; 41 1.5,-8; 42 2,-8; 43 2.5,-8; 44 3,-8; 45 3.5,-8; 46 4,-8; 47 4.5,-8; 48 5,-8; 49 5.5,-8; 50 6,-8; 76 6,8; 77 5.5,8; 78 5,8; 79 4.5,8; 80 4,8; 81 3.5,8; 82 3,8; 83 2.5,8; 84 2,8; 85 1.5,8; 86 1,8; 87 0.5,8; 88 0,8; 89 -0.5,8; 90 -1,8; 91 -1.5,8; 92 -2,8; 93 -2.5,8; 94 -3,8; 95 -3.5,8; 96 -4,8; 97 -4.5,8; 98 -5,8; 99 -5.5,8; 100 -6,8
1X05 = drill 1.016 long: 1 -5.08,0; 2 -2.54,0; 3 0,0; 4 2.54,0; 5 5.08,0

### Placement (x,y rotation side)
C1  59.94,9.65 270 top
C2  64.52,7.11 180 top
C3P  38.61,14.48 270 top
C4P  39.12,18.29 90 top
C5P  26.16,16.51 90 top
C6P  25.4,21.59 90 top
C7P  27.18,40.64 180 top
C8P  22.61,40.64 180 top
C9  13.72,13.46 180 top
C10P  24.89,52.83 270 top
C11  56.64,51.82 90 top
C12P  62.48,23.88 180 top
C13P  40.13,30.23 90 bottom
C14P  40.64,44.45 90 bottom
C15P  36.32,34.54 90 bottom
C16P  43.18,44.45 90 bottom
C17P  49.02,40.89 270 bottom
C18P  62.48,21.08 0 top
C19P  67.82,21.08 180 top
C20  67.06,51.82 90 top
C21P  42.42,50.04 90 top
C22P  77.98,22.86 0 top
C23P  45.21,38.1 90 bottom
C24P  67.82,23.88 0 top
C25  79.5,32 90 top
CLK  72.39,25.91 0 top
DIVIDER_OUT  58.67,25.4 0 top
I2C  12.7,31.5 90 top
IC1  66.29,14.22 270 top
IC2  33.27,52.07 270 top
IC3  67.31,34.8 90 top
IC4  89.66,41.91 270 top
IC5  58.67,18.54 180 top
IC7  44.2,18.03 0 top
IC8  31.5,18.03 0 top
IC9  25.4,35.31 270 top
IC10  88.9,25.15 270 top
JP1  34.54,6.35 0 bottom
L1  40.64,37.85 270 bottom
L2  46.23,32.26 0 bottom
LED2  83.82,55.37 270 top
LIMITS/ESTOP  5.08,44.7 90 top
MIRROR_MOTOR  12.7,43.43 90 top
PD  73.15,19.05 0 top
PDI  46.74,52.58 90 top
PLL_IN  56.64,15.24 0 top
R1  22.61,46.48 0 top
R2  57.15,11.94 90 top
R3  73.15,14.48 180 top
R4  69.09,7.11 180 top
R5  75.95,9.14 90 top
R6  24.89,15.24 270 bottom
R7  24.89,18.8 270 bottom
R8  41.15,63.25 0 top  (outside the outline)
R9  60.2,64.52 90 top  (outside the outline)
R10  40.64,45.21 180 top
R11  76.45,55.37 0 top
R12  12.7,10.67 180 top
R13  20.57,23.11 0 top
R14  20.57,25.4 180 top
R15  20.83,43.43 0 top
R16  87.88,55.37 180 top
R17  75.44,49.28 90 top
R18  52.32,66.04 270 top  (outside the outline)
R19  48.77,66.04 0 top  (outside the outline)
R20  46.99,24.64 90 bottom
R21  40.39,24.64 270 bottom
R22  46.99,20.83 90 bottom
R23  40.39,20.83 90 bottom
R_PLL_R1  73.15,10.41 180 top
R_PLL_R2  73.15,12.45 180 top
R_SF  73.15,8.38 0 top
STEPPER_MOTOR  5.08,31.5 90 top
SUPPLY12V  13.72,53.09 180 top
T1  44.7,65.02 0 top  (outside the outline)
T2  81.53,10.16 0 top
T3  43.69,24.64 270 bottom
T4  43.69,20.83 270 bottom
T6  56.13,66.04 270 top  (outside the outline)
TVS1  12.45,21.59 90 top
TVS2  14.73,21.59 90 top
TVS3  12.45,17.02 90 top
TVS4  14.73,17.02 90 top
U1  44.7,34.8 0 top
UART  21.34,52.58 90 top
USB  5.08,17.02 270 top
VCO_IN  70.61,4.83 0 top
YELLOW_LIGHT  82.04,5.08 180 top

### Tracks (layer width: path | path; a pad name or v marks a point on that pad's centre or on a via)
CTR0_KA  (via drill 0.6 pad 1.27)
  Top 0.254: U1.75 54.2,40.8 v54.61,41.15 | IC3.14 60.58,40.51 60.45,40.39 v59.18,40.39
  Bottom 0.254: v54.61,41.15 58.42,41.15 v59.18,40.39
CTR0_KB  (via drill 0.6 pad 1.27)
  Top 0.254: IC3.13 60.07,41.78 v59.94,41.91 | U1.76 50.7,43.59 51.31,44.2 53.34,44.2 v54.61,42.93
  Bottom 0.254: v59.94,41.91 55.63,41.91 v54.61,42.93
CTR0_KC  (via drill 0.6 pad 1.27)
  Top 0.254: IC3.11 70.74,40.51 70.1,39.88 70.1,28.96 70.61,28.45 75.44,28.45 v75.95,27.94 | U1.77 50.2,43.85 51.05,44.7 54.1,44.7 54.36,44.96 v55.63,44.96
  Bottom 0.254: v75.95,27.94 77.47,29.46 77.47,34.8 76.2,36.07 65.53,36.07 63.75,37.85 63.75,43.18 61.98,44.96 v55.63,44.96
CTR0_LE  (via drill 0.6 pad 1.27)
  Top 0.254: U1.78 49.7,44.12 50.8,45.21 53.09,45.21 53.59,45.72 v53.59,46.48 | IC3.2 76.58,29.08 v77.98,27.94
  Bottom 0.254: v53.59,46.48 56.9,46.48 57.91,45.47 62.23,45.47 64.26,43.43 64.26,38.1 65.79,36.58 76.45,36.58 77.98,35.05 v77.98,27.94
CTR0_PROG0  (via drill 0.6 pad 1.27)
  Top 0.254: U1.55 54.29,30.8 55.12,29.97 v55.12,27.69 | IC3.3 75.82,30.35 v75.95,30.23
  Bottom 0.254: v75.95,30.23 63.75,30.23 59.69,26.16 56.64,26.16 v55.12,27.69
CTR0_PROG1  (via drill 0.6 pad 1.27)
  Top 0.254: U1.56 54.55,31.3 56.64,29.21 v56.64,27.69 | IC3.4 74.55,31.62 v74.68,31.5
  Bottom 0.254: v56.64,27.69 57.66,26.67 58.67,26.67 63.5,31.5 v74.68,31.5
CTR0_PROG2  (via drill 0.6 pad 1.27)
  Top 0.254: U1.57 54.82,31.8 57.15,29.46 57.15,28.7 v58.17,27.69 | IC3.5 75.82,32.89 v75.95,32.77
  Bottom 0.254: v75.95,32.77 63.25,32.77 v58.17,27.69
CTR0_PROG3  (via drill 0.6 pad 1.27)
  Top 0.254: U1.58 55.08,32.3 v58.17,29.21 | IC3.6 74.55,34.16 v74.68,34.04
  Bottom 0.254: v58.17,29.21 62.99,34.04 v74.68,34.04
CTR0_PROG4
  Top 0.254: U1.59 55.34,32.8 57.78,30.35 IC3.22
CTR0_PROG5
  Top 0.254: U1.60 55.6,33.3 57.28,31.62 IC3.21
CTR0_PROG6
  Top 0.254: U1.61 55.86,33.8 56.77,32.89 IC3.20
CTR0_PROG7
  Top 0.254: U1.62 56.13,34.3 56.64,33.78 57.66,33.78 58.04,34.16 IC3.19
CTR0_PROG8
  Top 0.254: U1.65 57.67,35.8 58.04,35.43 IC3.18
CTR0_PROG9
  Top 0.254: U1.66 57.63,36.3 58.04,36.7 IC3.17
CTR0_PROG10
  Top 0.254: IC3.16 58.55,37.97 57.37,36.8 U1.67
CTR0_PROG11
  Top 0.254: IC3.15 59.05,39.24 57.11,37.3 U1.68
CTR0_PROG12
  Top 0.254: U1.69 56.85,37.8 58.17,39.12 58.17,42.42 58.93,43.18 73.66,43.18 74.42,42.42 74.42,39.62 74.04,39.24 IC3.10
CTR0_PROG13
  Top 0.254: U1.70 56.59,38.3 57.66,39.37 57.66,42.67 58.67,43.69 73.91,43.69 74.93,42.67 74.93,38.61 74.3,37.97 IC3.9
CTR0_PROG14
  Top 0.254: U1.71 56.32,38.8 57.15,39.62 57.15,42.93 58.42,44.2 74.17,44.2 75.44,42.93 75.44,37.59 74.55,36.7 IC3.8
CTR0_PROG15
  Top 0.254: U1.72 56.06,39.3 56.64,39.88 56.64,43.18 58.17,44.7 74.42,44.7 75.95,43.18 75.95,36.58 74.8,35.43 IC3.7
DIVIDER_OUT
  Top 0.254: 58.17,22.1 53.09,22.1 52.58,22.61 52.58,24.13 50.7,26 U1.50 | DIVIDER_OUT.TP 58.67,22.61 58.17,22.1 | IC5.1 59.32,20.94 58.17,22.1
GND  (via drill 0.6 pad 1.27)  (1 unrouted)
  Top 0.254: U1.33 42.2,25.69 | U1.13 38.61,34.8 | 42.2,43.9 U1.93 42.2,41.19 | 46.7,43.91 U1.84 46.7,41.18 | 51.31,29.8 U1.53 53.85,29.8 | U1.73 54.36,39.8 | U1.63 v57.15,34.8 | U1.23 35.64,29.8 35.56,29.72 | U1.43 47.2,24.68 47.75,24.13 47.75,23.11
  Top 0.406: T1.E 57.74,63.92 58,63.67 R9.1 63.84,63.67 64.52,62.99 65.53,62.99
  Top 1.27: IC10.1 79.76,27.43
  Bottom 0.406: C23P.2 C17P.2
  other vias: 35.56,27.43 53.59,26.67 17.02,26.16 9.65,24.13 49.28,46.99 56.64,20.32 65.28,26.16 36.58,14.48 28.45,52.07 23.37,21.34 78.74,41.91 15.49,45.97 9.65,35.31 76.96,26.42 52.58,5.08 19.56,39.88 19.81,30.99
  pour Bottom (isolate 0.305, rank 6): 0,59.94 100.08,59.94 100.08,0 0,0
  pour Top (isolate 0.305, rank 6): 0,59.94 100.08,59.94 100.08,0 0,0
I2C_SDA_3V2  (via drill 0.6 pad 1.27)
  Top 0.254: U1.46 48.7,24.45 49.78,23.37 v49.78,22.86
  Bottom 0.254: T3.2 44.89,23.79 R20.1 47.08,23.88 49.28,23.88 49.78,23.37 v49.78,22.86
I2C_SDA_3V4  (via drill 0.6 pad 1.27)
  Top 0.254: U1.45 48.2,24.19 48.77,23.62 48.77,21.59 v49.78,20.57
  Bottom 0.254: T4.2 44.89,19.98 R22.1 49.19,19.98 v49.78,20.57
I2C_SDA_5V2  (via drill 0.6 pad 1.27)
  Top 0.254: v25.91,25.4 24.64,25.4 23.37,26.67 23.37,28.19 22.1,29.46 19.3,29.46 v17.78,30.99
  Bottom 0.254: 42.67,24.72 T3.3 41.74,25.49 R21.1 39.46,25.49 38.86,24.89 38.86,22.1 38.1,21.34 31.75,21.34 27.43,25.4 v25.91,25.4 | I2C.3 14.48,32.77 16.51,30.99 v17.78,30.99
I2C_SDA_5V3  (via drill 0.6 pad 1.27)
  Top 0.254: v26.92,24.13 24.13,24.13 22.86,25.4 22.86,27.94 21.84,28.96 19.05,28.96 18.54,29.46 v16.76,29.46
  Bottom 0.254: T4.3 41.74,19.98 R23.1 31.08,19.98 v26.92,24.13 | v16.76,29.46 16,29.46 15.24,30.23 I2C.2
LM_CLK  (via drill 0.6 pad 1.27)  (1 unrouted)
  Top 0.254: CLK.TP 72.34,25.96 IC3.1 68.71,27.81 67.82,26.92 67.82,16.26 66.42,14.86 IC1.4 58.55,14.86 v58.42,14.99
  Bottom 0.254: JP1.21 26.67,2.79 57.15,2.79 58.42,4.06 v58.42,14.99
LM_DATA_3V3_0
  Top 0.254: IC7.21 42.57,24.03 43.2,24.66 U1.35
LM_DATA_3V3_1
  Top 0.254: IC7.20 43.22,23.92 43.69,24.38 43.69,26.78 U1.36
LM_DATA_3V3_2
  Top 0.254: IC7.19 43.87,23.8 44.2,24.14 U1.37
LM_DATA_3V3_3
  Top 0.254: IC7.18 44.52,23.69 44.7,23.88 U1.38
LM_DATA_3V3_4
  Top 0.254: U1.39 45.2,22 IC7.17
LM_DATA_3V3_5
  Top 0.254: U1.40 45.7,23.89 45.82,23.77 IC7.16
LM_DATA_3V3_6
  Top 0.254: IC7.15 46.47,23.89 46.2,24.15 U1.41
LM_DATA_3V3_7
  Top 0.254: IC7.14 47.12,24 46.7,24.42 U1.42
LM_DATA_3V3_8
  Top 0.254: U1.15 33.54,33.8 29.87,30.12 IC8.21
LM_DATA_3V3_9
  Top 0.254: U1.16 33.81,33.3 30.52,30.01 IC8.20
LM_DATA_3V3_10
  Top 0.254: U1.17 34.07,32.8 31.17,29.9 IC8.19
LM_DATA_3V3_11
  Top 0.254: U1.18 34.33,32.3 31.82,29.79 IC8.18
LM_DATA_3V3_12
  Top 0.254: U1.19 34.59,31.8 32.47,29.68 IC8.17
LM_DATA_3V3_13
  Top 0.254: U1.20 34.85,31.3 33.12,29.57 IC8.16
LM_DATA_3V3_14
  Top 0.254: U1.21 35.12,30.8 33.77,29.45 IC8.15
LM_DATA_3V3_15
  Top 0.254: IC8.14 34.42,29.34 35.38,30.3 U1.22
LM_DATA_5V0  (via drill 0.6 pad 1.27)
  Top 0.254: IC7.10 46.47,13.73 48.51,11.68 v48.51,9.91
  Bottom 0.254: JP1.3 48.51,6.35 v48.51,9.91
LM_DATA_5V1  (via drill 0.6 pad 1.27)
  Top 0.254: IC7.9 45.82,13.62 47.24,12.19 v47.24,11.43
  Bottom 0.254: v47.24,11.43 JP1.4
LM_DATA_5V2  (via drill 0.6 pad 1.27)
  Top 0.254: IC7.8 45.17,13.5 45.97,12.7 v45.97,9.91
  Bottom 0.254: v45.97,9.91 45.97,6.35 JP1.5
LM_DATA_5V3  (via drill 0.6 pad 1.27)
  Top 0.254: IC7.7 44.52,13.39 44.7,13.21 v44.7,11.43
  Bottom 0.254: v44.7,11.43 JP1.6
LM_DATA_5V4  (via drill 0.6 pad 1.27)
  Top 0.254: IC7.6 43.87,13.39 43.43,12.95 v43.43,9.91
  Bottom 0.254: v43.43,9.91 43.43,6.35 JP1.7
LM_DATA_5V5  (via drill 0.6 pad 1.27)
  Top 0.254: IC7.5 43.22,13.5 42.16,12.45 v42.16,11.43
  Bottom 0.254: v42.16,11.43 JP1.8
LM_DATA_5V6  (via drill 0.6 pad 1.27)
  Top 0.254: IC7.4 42.57,13.62 40.89,11.94 v40.89,9.91
  Bottom 0.254: v40.89,9.91 40.89,6.35 JP1.9
LM_DATA_5V7  (via drill 0.6 pad 1.27)
  Top 0.254: IC7.3 41.92,13.73 v39.62,11.43
  Bottom 0.254: v39.62,11.43 JP1.10
LM_DATA_5V8  (via drill 0.6 pad 1.27)
  Top 0.254: IC8.10 33.77,13.73 35.81,11.68 v35.81,9.91
  Bottom 0.254: JP1.13 35.81,6.35 v35.81,9.91
LM_DATA_5V9  (via drill 0.6 pad 1.27)
  Top 0.254: IC8.9 33.12,13.62 34.54,12.19 v34.54,11.43
  Bottom 0.254: JP1.14 v34.54,11.43
LM_DATA_5V10  (via drill 0.6 pad 1.27)
  Top 0.254: IC8.8 32.47,13.5 33.27,12.7 v33.27,9.91
  Bottom 0.254: JP1.15 33.27,6.35 v33.27,9.91
LM_DATA_5V11  (via drill 0.6 pad 1.27)
  Top 0.254: IC8.7 31.82,13.39 32,13.21 v32,11.43
  Bottom 0.254: JP1.16 v32,11.43
LM_DATA_5V12  (via drill 0.6 pad 1.27)
  Top 0.254: IC8.6 31.17,13.39 30.73,12.95 v30.73,9.91
  Bottom 0.254: JP1.17 30.73,6.35 v30.73,9.91
LM_DATA_5V13  (via drill 0.6 pad 1.27)
  Top 0.254: IC8.5 30.52,13.5 29.46,12.45 v29.46,11.43
  Bottom 0.254: JP1.18 v29.46,11.43
LM_DATA_5V14  (via drill 0.6 pad 1.27)
  Top 0.254: IC8.4 29.87,13.62 28.19,11.94 v28.19,9.91
  Bottom 0.254: JP1.19 28.19,6.35 v28.19,9.91
LM_DATA_5V15  (via drill 0.6 pad 1.27)
  Top 0.254: IC8.3 29.22,13.73 v26.92,11.43
  Bottom 0.254: JP1.20 v26.92,11.43
LM_LASER_ENABLE  (via drill 0.6 pad 1.27)
  Top 0.254: IC9.6 20.14,35.63 v18.8,34.29
  Bottom 0.254: v18.8,34.29 21.08,34.29 21.59,33.78 21.59,25.91 19.3,23.62 19.3,13.21 20.07,12.45 20.07,8.38 JP1.26
LM_LATCH  (via drill 0.6 pad 1.27)
  Top 0.254: IC9.3 21.86,37.58 21.84,37.59 20.32,37.59 20.07,37.85 17.27,37.85 16.26,36.83 16.26,33.02 v16.76,32.51 | v38.35,9.91 38.35,6.86 37.85,6.35 18.03,6.35 v16.76,7.62
  Bottom 0.254: v38.35,9.91 38.35,6.35 JP1.11 | v16.76,32.51 15.24,34.04 10.92,34.04 10.41,33.53 10.41,26.16 11.94,24.64 15.49,24.64 16.26,23.88 16.26,8.13 v16.76,7.62
LM_LD_PWR_BIT_0  (via drill 0.6 pad 1.27)
  Top 0.254: IC9.4 18.9,36.93 v18.8,36.83
  Bottom 0.254: JP1.23 23.11,6.35 23.11,14.99 22.86,15.24 20.83,15.24 20.32,15.75 20.32,23.11 22.61,25.4 22.61,35.81 21.59,36.83 v18.8,36.83
LM_LD_PWR_BIT_1  (via drill 0.6 pad 1.27)
  Top 0.254: 20.79,36.28 IC9.5 19.77,36.28 19.05,35.56 v17.53,35.56
  Bottom 0.254: JP1.25 20.57,6.35 20.57,12.7 19.81,13.46 19.81,23.37 22.1,25.65 22.1,34.8 21.34,35.56 v17.53,35.56
LM_PREFETCH
  Bottom 0.254: JP1.22 24.38,12.45 24.89,12.95 R6.2
LOCK_ACQUIRED
  Top 0.254: IC1.1 61.59,18.67 59.69,16.76 58.93,16.76 58.67,17.02 58.67,18.29 58.42,18.54 52.07,18.54 51.56,19.05 51.56,23.62 49.7,25.48 U1.48
N$1  (via drill 0.6 pad 1.27)
  Top 0.254: U1.6 31.3,38.3 v30.73,38.86
  Bottom 0.254: R6.1 R7.2 25.82,17.95 27.18,19.3 27.18,21.34 26.16,22.35 25.15,22.35 24.64,22.86 24.64,38.1 25.4,38.86 v30.73,38.86
N$2
  Top 0.406: T6.B 55.03,66.89 R18.1 52.24,66.8 51.31,66.8 50.55,66.04 R19.2
N$3  (via drill 0.6 pad 1.27)
  Top 0.254: U1.100 38.7,43.85 38.1,44.45 v37.08,44.45
  Bottom 0.254: v37.08,44.45 33.02,44.45 30.23,47.24 9.14,47.24 7.87,45.97 LIMITS/ESTOP.3
N$4  (via drill 0.6 pad 1.27)
  Top 0.254: v54.61,23.37 52.32,25.65 52.32,27.69 52.7,28.07 U1.51 | R5.2 75.95,16 v75.18,16.76
  Bottom 0.254: v54.61,23.37 58.93,23.37 62.74,19.56 74.17,19.56 75.18,18.54 v75.18,16.76
N$5  (via drill 0.6 pad 1.27)
  Top 0.254: U1.89 44.2,44.97 44.7,45.47 v48.01,45.47
  Bottom 0.254: v48.01,45.47 PDI.1
N$6
  Top 0.254: IC1.6 61.21,12.32 C1.1
N$7
  Top 0.254: U1.7 32.21,37.8 31.99,37.58 IC9.22
N$8
  Top 0.254: IC1.7 61.85,11.05 61.47,10.67 61.47,9.78 C1.2
N$9
  Top 0.254: IC1.13 70.74,14.86 71.12,14.48 R3.2
N$10
  Top 0.254: R4.1 69.94,8.29 69.37,8.87 IC1.9 | R3.1 74,14.31 73.15,13.46 73.15,7.37 72.9,7.11 R4.1 | R4.1 69.94,5.5 VCO_IN.TP
N$11
  Top 0.254: C2.1 R4.2
N$12
  Top 0.254: 72.14,8.38 R_SF.1 71.63,8.38 71.12,8.89 71.12,10.16 70.23,11.05 IC1.10
N$13
  Top 0.254: IC1.11 70.48,12.32 71.12,11.68 71.12,10.92 71.63,10.41 R_PLL_R1.2
N$14
  Top 0.254: IC1.12 70.48,13.59 71.12,12.95 71.12,12.7 71.37,12.45 R_PLL_R2.2
N$15
  Top 0.254: U1.8 32.47,37.3 32.1,36.93 IC9.21
N$16
  Top 0.254: U1.9 32.73,36.8 32.22,36.28 IC9.20
N$17
  Top 0.254: U1.10 33,36.3 32.33,35.63 IC9.19
N$18  (via drill 0.6 pad 1.27)
  Top 0.254: 80.52,44.7 IC4.1 80.01,44.45
  Top 0.406: R11.1 75.03,54.25 75.69,53.59 77.22,53.59 78.74,52.07 v78.74,49.28 78.74,45.72 80.01,44.45
  Bottom 0.406: R17.E R17.S v78.74,49.28
N$19  (via drill 0.6 pad 1.27)
  Top 0.406: R11.2 77.88,54.2 81.79,50.29
  Top 0.813: v8.89,40.89 v8.89,49.28
  Bottom 0.813: MIRROR_MOTOR.1 v8.89,40.89
  Bottom 1.27: v8.89,49.28 8.89,54.61 11.68,57.4 67.82,57.4 70.61,54.61 79.25,54.61 82.8,51.05
  other vias: 85.85,50.29 87.88,49.28 89.92,50.29 91.95,49.28 93.98,50.29 93.98,33.53 91.95,34.54 89.92,33.53 87.88,34.54 85.85,33.53
  pour Top (isolate 0.406, no thermals): 97.28,51.56 97.28,32 80.52,32 80.52,51.56
  pour Bottom (isolate 0.406, no thermals): 82.3,51.56 97.28,51.56 97.28,32 82.3,32
N$20
  Top 0.254: U1.99 39.2,44.63 R10.2
N$21
  Top 0.254: T2.2 T2.2@1
  Top 0.813: YELLOW_LIGHT.2 80.77,6.35 81.53,7.11 T2.2
  pour Top (isolate 0.305, no thermals): 77.72,9.4 85.34,9.4 85.34,14.99 77.72,14.99
N$22
  Top 0.254: T2.1 76.06,8.18 R5.1
N$23  (via drill 0.6 pad 1.27)
  Top 0.254: U1.90 43.7,45.74 44.96,46.99 v46.74,46.99
  Bottom 0.254: v46.74,46.99 46.74,53.85 PDI.5
N$24  (via drill 0.6 pad 1.27)
  Top 0.254: TVS3.2 TVS1.1 | v9.65,19.56 10.67,20.57 TVS1.1 | TVS1.1 13.46,21.59 19.3,21.59 21.84,19.05 35.31,19.05 37.34,21.08 38.1,21.08 39.12,22.1 39.12,23.11 41.2,25.2 U1.31
  Bottom 0.254: USB.2 v9.65,19.56
N$25  (via drill 0.6 pad 1.27)
  Top 0.254: v9.65,17.02 13.72,17.02 TVS4.2 TVS2.1 19.56,20.57 21.59,18.54 35.56,18.54 37.59,20.57 38.35,20.57 39.62,21.84 39.62,22.86 41.7,24.94 U1.32
  Bottom 0.254: USB.3 v9.65,17.02
N$26  (via drill 0.6 pad 1.27)
  Top 0.254: U1.27 39.2,25.49 38.1,24.38 v36.07,24.38 | R1.1 21.68,45.9 R15.2 23.37,43.43 24.89,41.91 24.89,38.61 24.13,37.85 24.13,29.21 25.65,27.69 v26.92,27.69
  Bottom 0.254: v36.07,24.38 32,24.38 28.7,27.69 v26.92,27.69
N$27  (via drill 0.6 pad 1.27)
  Top 0.254: R10.1 41.49,46.14 40.89,46.74 35.81,46.74 35.05,45.97 27.69,45.97 27.18,45.47 v27.18,44.7
  Bottom 0.254: v27.18,44.7 26.16,43.69 15.75,43.69 15.49,43.43 MIRROR_MOTOR.2
N$28  (via drill 0.6 pad 1.27)
  Top 0.254: IC9.18 26.85,34.98 26.16,34.29 v26.16,30.23 | v37.34,22.86 39.7,25.23 U1.28
  Bottom 0.254: v37.34,22.86 31.75,22.86 27.94,26.67 26.42,26.67 25.65,27.43 25.65,29.72 v26.16,30.23
N$29  (via drill 0.6 pad 1.27)
  Top 0.254: v9.65,22.1 10.16,22.61 TVS1.2 TVS2.2 19.22,22.61 R13.1
  Bottom 0.254: USB.1 v9.65,22.1
N$30  (via drill 0.6 pad 1.27)
  Top 0.254: C9.2 11.18,13.46 v9.65,11.94 10.92,10.67 R12.2
  Bottom 0.254: USB.5 v9.65,11.94
N$31
  Top 0.254: R14.1 R13.2 21.42,20.23 22.1,19.56 35.05,19.56 37.08,21.59 37.85,21.59 38.61,22.35 38.61,23.37 40.7,25.46 U1.30
N$32  (via drill 0.6 pad 1.27)
  Top 0.254: v35.05,42.42 35.05,45.21 36.07,46.23 40.39,46.23 40.64,45.97 40.64,43.94 40.7,43.88 U1.96
  Bottom 0.254: STEPPER_MOTOR.3 6.35,32.77 7.37,33.78 7.37,37.34 9.14,39.12 14.48,39.12 14.99,39.62 14.99,41.4 16.26,42.67 26.42,42.67 26.67,42.42 v35.05,42.42
N$33  (via drill 0.6 pad 1.27)
  Top 0.254: U1.1 34.64,40.8 v30.73,44.7
  Bottom 0.254: LIMITS/ESTOP.2 7.87,43.43 9.14,44.7 19.56,44.7 21.08,46.23 29.21,46.23 v30.73,44.7
N$34  (via drill 0.6 pad 1.27)
  Top 0.254: U1.2 34.38,40.3 31.24,43.43 v29.21,43.43
  Bottom 0.254: LIMITS/ESTOP.1 6.86,40.89 8.13,42.16 14.99,42.16 16,43.18 28.96,43.18 v29.21,43.43
N$35  (via drill 0.6 pad 1.27)
  Top 0.254: U1.11 33.26,35.8 32,34.54 v30.73,34.54
  Bottom 0.254: STEPPER_MOTOR.1 6.86,27.18 8.38,28.7 8.38,36.83 9.65,38.1 14.99,38.1 16,39.12 16,40.89 16.76,41.66 25.91,41.66 26.16,41.4 32.51,41.4 33.27,40.64 33.27,35.81 32,34.54 v30.73,34.54
N$36  (via drill 0.6 pad 1.27)
  Top 0.254: U1.12 33.52,35.3 30.99,32.77 v30.73,32.77
  Bottom 0.254: STEPPER_MOTOR.2 6.6,30.23 7.87,31.5 7.87,37.08 9.4,38.61 14.73,38.61 15.49,39.37 15.49,41.15 16.51,42.16 26.16,42.16 26.42,41.91 32.77,41.91 33.78,40.89 33.78,35.56 30.99,32.77 v30.73,32.77
N$37
  Top 0.254: R16.2 LED2.C
N$38  (via drill 0.6 pad 1.27)
  Top 0.254: v17.78,39.88 v17.78,48.51 | IC9.7 20.76,34.98 20.07,34.29 20.07,33.78 v18.8,32.51
  Bottom 0.254: v17.78,39.88 17.27,39.37 17.27,38.35 16,37.08 16,35.05 18.54,32.51 v18.8,32.51 | v17.78,48.51 19.81,48.51 UART.1
N$39  (via drill 0.6 pad 1.27)
  Top 0.254: v24.13,48.77 24.13,48.01 23.46,47.33 R1.2
  Bottom 0.254: UART.2 23.37,52.58 24.13,51.82 v24.13,48.77
N$41
  Top 0.406: R8.2 43.75,63.25 T1.B
N$42
  Top 0.406: T1.C 47.92,66.12 R19.1
N$43  (via drill 0.6 pad 1.27)
  Top 0.254: 36.71,34.29 U1.14 37.84,34.3 38.1,34.04 | U1.34 42.7,28.16 | U1.44 47.7,27.99 47.5,28.19 | U1.83 47.2,41.7 47.5,41.4 | U1.64 51.32,35.3 | U1.74 51.4,40.3 | U1.24 38.01,29.3 | U1.54 51.49,30.3 51.31,30.48
  Top 0.356: 38.1,29.21 38.1,34.04 | 47.5,28.19 42.67,28.19 | 42.67,28.19 38.1,28.19 | 47.5,41.4 51.31,41.4 | 51.31,40.39 51.31,41.4 | 51.31,41.4 v52.32,42.42 | 51.31,30.48 51.31,35.31 | 51.31,35.31 51.31,40.39 | 38.1,28.19 38.1,29.21 | v37.34,27.43 38.1,28.19 | 42.7,28.16 42.67,28.19 | 38.01,29.3 38.1,29.21 | 51.4,40.3 51.31,40.39 | 51.32,35.3 51.31,35.31
  Bottom 0.406: v37.34,27.43 38.73,28.83 C13P.1 47.11,28.83 48.18,29.89 L2.1 48.18,35.22 49.53,36.58 51.31,36.58 52.32,37.59 v52.32,42.42 49.15,42.42 C17P.1
N$44  (via drill 0.6 pad 1.27)
  Top 0.254: U1.4 37.77,39.3 | U1.94 41.7,41.7 41.4,41.4
  Top 0.356: 37.77,39.3 38.1,39.62 38.1,41.4 | 41.4,41.4 38.1,41.4 | 38.1,41.4 v37.08,42.42
  Bottom 0.406: C14P.1 C16P.1 | L1.1 C14P.1 | v37.08,42.42 38.61,42.42 39.24,43.05 C14P.1
N$77  (via drill 0.6 pad 1.27)
  Top 0.254: U1.5 33.34,38.8 v32,40.13
  Bottom 0.254: 22.77,17.95 23.62,18.8 25.91,18.8 26.67,19.56 26.67,21.08 25.91,21.84 24.89,21.84 24.13,22.61 24.13,38.35 25.91,40.13 v32,40.13
PD_SIGNAL  (via drill 0.6 pad 1.27)
  Top 0.254: PD.TP v73.15,16.76 72.52,16.13 IC1.14
  Bottom 0.254: JP1.12 37.08,12.19 37.85,12.95 54.1,12.95 56.13,14.99 56.13,15.75 56.9,16.51 58.67,16.51 60.45,14.73 71.12,14.73 v73.15,16.76
PLL_CIN_ENABLE
  Top 0.254: U1.49 50.2,25.74 52.07,23.88 52.07,22.35 52.83,21.59 57.91,21.59 58.67,20.83 IC5.2
PLL_IN_3V3  (1 unrouted)
  Top 0.254: 55.31,14.32 55.31,16.26 56.64,16.26 | 56.64,16.26 57.66,16.26 58.02,16.62 IC5.4 | PLL_IN.TP 56.64,16.26
  Top 0.406: R8.1 40.3,61.05
PLL_IN_5V  (via drill 0.6 pad 1.27)  (1 unrouted)
  Top 0.254: IC1.3 61.09,16.13 v60.96,16
  Top 0.406: T6.C 59.27,66.04 R9.2 63.84,65.37 64.52,66.04 65.53,66.04
  Bottom 0.406: v60.96,16 60.96,16.76 59.69,18.03
PLL_INHIBIT
  Top 0.254: U1.47 49.2,25.22 51.05,23.37 51.05,13.72 51.82,12.95 56.98,12.95 R2.2 57.95,13.59 IC1.5
VCC/3.3V  (via drill 0.6 pad 1.27)  (1 unrouted)
  Top 0.254: 32.26,49.02 32.26,51.31 33.02,52.07 | IC8.24 26.13,21.71 C6P.2 | IC9.24 29.08,39.59 C7P.1
  Top 0.406: IC7.24 IC7.23 41.27,19.69 | IC8.24 IC8.23 28.57,28.96 | 28.57,28.96 28.57,29.59 v27.94,30.23 | IC9.24 IC9.23 25.53,38.23 24.89,37.59 24.89,29.46 25.4,28.96 28.57,28.96 | 53.41,14.32 53.41,16 v52.07,16 | C18P.1 61.08,19.17 60.45,18.54 59.69,18.54 59.32,18.18 IC5.5 | C7P.1 28.03,41.82 27.43,42.42 26.16,42.42 25.4,43.18 25.4,46.48 26.27,47.35 30.59,47.35 32.26,49.02 | 41.27,19.69 41.91,19.05 48.77,19.05 49.28,18.54 v49.28,17.27 | C4P.2 40.72,19.14 41.27,19.69
  Top 0.61: 33.02,52.07 33.02,52.48 | C21P.+ 36.82,51.41 IC2.4
  Bottom 0.254: 44.89,25.49 T3.1 | 44.89,21.68 T4.1 44.52,21.78 | T3.1 44.64,25.59 44.52,25.59 | T3.1 44.77,25.59 | v39.62,55.12 42.93,55.12 43.69,54.36 43.69,51.82 PDI.2 | C15P.+ 35.92,35.92
  Bottom 0.406: R20.2 44.89,25.49 | 44.89,21.68 R22.2 51.05,21.68 51.56,21.17 51.56,17.27 | 44.64,25.59 43.69,24.64 43.69,22.61 44.52,21.78 | C15P.+ 40.62,35.92 L1.2 44.28,35.9 | L2.2 44.28,35.9 | 33.02,28.7 29.46,28.7 v27.94,30.23 | 33.02,28.7 34.29,29.97 34.29,34.29 35.92,35.92 | 44.52,25.59 43.18,26.92 39.37,26.92 38.35,25.91 34.04,25.91 33.02,26.92 33.02,28.7 | v49.28,17.27 51.56,17.27 | 51.56,17.27 51.56,16.51 v52.07,16 | C23P.1 45.08,36.7 44.28,35.9
  pour Top (isolate 0.406, no thermals): 31.24,56.39 40.64,56.39 40.64,48.26 31.24,48.26
VCC/5V  (via drill 0.6 pad 1.27)  (2 unrouted)
  Top 0.254: v18.03,28.19 16.26,28.19 15.24,29.21 15.24,37.59 16,38.35 19.81,38.35 20.34,38.88 IC9.1 21.72,40.6 C8P.2 | IC8.1 27.92,15.75 | 27.92,15.75 27.92,16.75 28.45,17.27 36.32,17.27 v36.58,17.02 38.27,15.33 C3P.1 40.51,15.33 40.62,15.22 IC7.1 | v18.29,11.18 19.3,11.18 20.07,11.94 20.07,14.73 20.99,15.66 C5P.1 27.83,15.66 27.92,15.75 | 69.37,21.19 C19P.1 | 69.37,23.7 C24P.+
  Top 0.406: IC1.16 69.37,21.19 69.37,23.7 | v49.28,14.48 49.28,13.21 50.8,11.68 53.09,11.68 54.1,10.67 v54.1,7.62 | C19P.1 74.42,21.08 75.69,19.81 v76.96,19.81 | C12P.2 61.08,25.52 62.28,26.72 IC3.24 | 65.53,64.52 58.93,64.52 58.67,64.77 56.13,64.77 55.81,65.09 T6.E 55.03,65.19 R18.2
  Top 1.27: v60.45,5.59 56.13,5.59 v54.1,7.62
  Bottom 0.254: R21.2 R23.2 43.6,21.68 43.69,21.59 43.69,18.29 42.93,17.53 | I2C.1 15.49,27.69 16,28.19 v18.03,28.19 18.8,27.43 18.8,25.4 17.78,24.38 17.78,11.68 v18.29,11.18
  Bottom 0.406: v36.58,17.02 37.08,17.53 42.93,17.53 42.93,15.24 43.69,14.48 v49.28,14.48 52.83,14.48 53.76,15.41 | v76.96,19.81 78.11,18.67
  Bottom 1.27: JP1.2 v54.1,7.62 | v60.45,5.59 68.07,5.59 77.47,14.99 77.47,18.03 78.11,18.67 79.5,20.07 v82.8,20.07
  pour Top (isolate 0.406, no thermals): 80.52,31.24 97.28,31.24 97.28,18.54 80.52,18.54
VCC/12V  (via drill 0.6 pad 1.27)
  Top 0.254: LED2.A 82.77,55.41 80.77,57.4 72.64,57.4 70.1,54.87
  Top 0.61: 66.55,54.86 C20.+ | 30.99,57.4 30.73,57.15 30.73,51.56 28.96,49.79 IC2.3 26.42,49.78 24.89,51.31 C10P.2 | IC10.3 84.08,22.87 84.07,22.86 | 81.03,39.12 IC4.3
  Top 1.27: v72.39,50.55 72.39,52.83 70.36,54.87 70.1,54.87 C20.+ C11.+ 52.58,54.87 50.04,57.4 30.99,57.4 19.3,57.4 18.29,56.39 v18.29,54.61 | IC4.3 79.5,38.1 v79.5,36.32 C25.2 | YELLOW_LIGHT.1 86.61,5.08 87.63,6.1 87.63,16.26 86.61,17.27 80.26,17.27 79.5,18.03 79.5,22.74 C22P.2 | 84.08,22.87 C22P.2 | v79.5,25.15 79.5,22.98 C22P.2
  Bottom 1.27: v72.39,50.55 72.39,43.43 v79.5,36.32 79.5,30.48 80.26,29.72 80.26,25.91 v79.5,25.15 | v18.29,54.61 16.51,54.61 SUPPLY12V.1

### Text on the board
Top: GND | T | 3 | R | 1
Bottom: +
tNames: 0 | 0 | ESTOP | L- | EN | L+ | VCC | 0 | 0 | CLK | SCL | DIR | SDA | EN | 5V | VUSB | D- | D+ | 0 | SHIELD